# Altium schematic sheet Sheet_708_5981.SchDoc
size A4
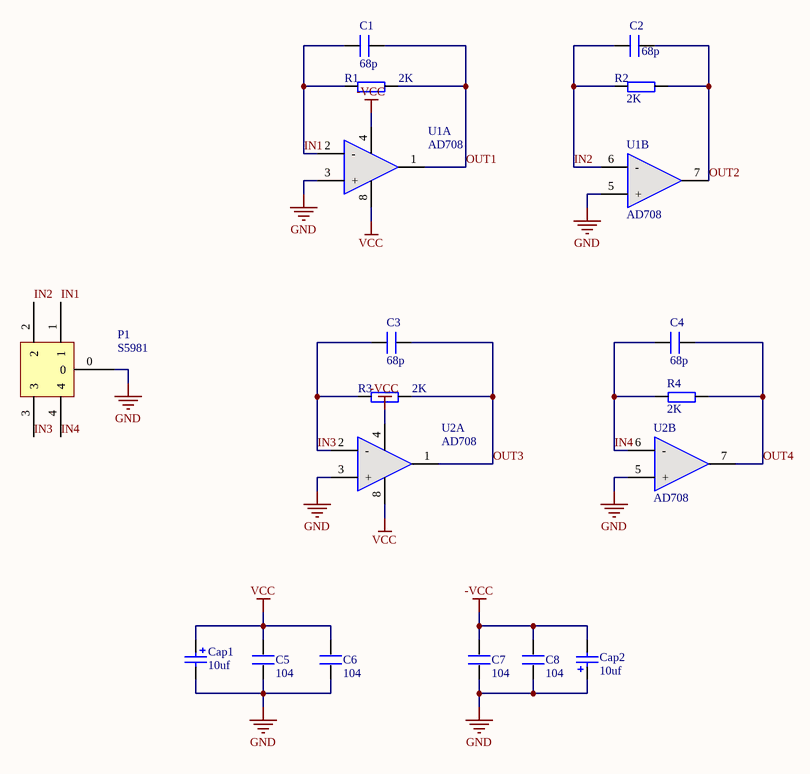
[diagram p0: Sheet_708_5981.SchDoc]

## Parts
C1  68p  [0603P]
C2  68p  [0603P]
C3  68p  [0603P]
C4  68p  [0603P]
C5  104  [0603P]
C6  104  [0603P]
C7  104  [0603P]
C8  104  [0603P]
Cap1  value 10uf  [电容-3216]  (hidden comment: 10uF钽电容3216)
Cap2  value 10uf  [电容-3216]  (hidden comment: 10uF钽电容3216)
P1  S5981  [S5981]
R1  2K  [0603P]
R2  2K  [0603P]
R3  2K  [0603P]
R4  2K  [0603P]
U1  AD708  [NSO8_N]  (parts A,B of 2)
U2  AD708  [NSO8_N]  (parts A,B of 2)

## Nets
-VCC: C7.2 C8.2 Cap2.2 U1.4(V-) U2.4(V-)
GND: C5.1 C6.1 C7.1 C8.1 Cap1.2 Cap2.1 P1.0 U1.3(+) U1.5(+) U2.3(+) U2.5(+)
VCC: C5.2 C6.2 Cap1.1 U1.8(V+) U2.8(V+)
IN1: C1.1 P1.1 R1.1 U1.2(-)
IN2: C2.1 P1.2 R2.1 U1.6(-)
IN3: C3.1 P1.3 R3.1 U2.2(-)
IN4: C4.1 P1.4 R4.1 U2.6(-)
OUT1: C1.2 R1.2 U1.1(OUT1)
OUT2: C2.2 R2.2 U1.7(OUT2)
OUT3: C3.2 R3.2 U2.1(OUT1)
OUT4: C4.2 R4.2 U2.7(OUT2)

## Library data of the parts
C1-C8 = C
Cap1 Cap2 = 3电解电容: Polarized Capacitor (Radial); Published: 8-Jun-2000; LatestRevisionDate: 17-Jul-2002; LatestRevisionNote: Re-released for DXP Platform.; PackageReference: RB7.6-15; Publisher: Altium Limited; PackageDescription: Polarized Capacitor (Radial); 2 Leads
P1 = Component_1
R1-R4 = R
U1 U2 = LM358: 双运放